# EAGLE design fat-pepper-preamp (EAGLE 7.6.0)
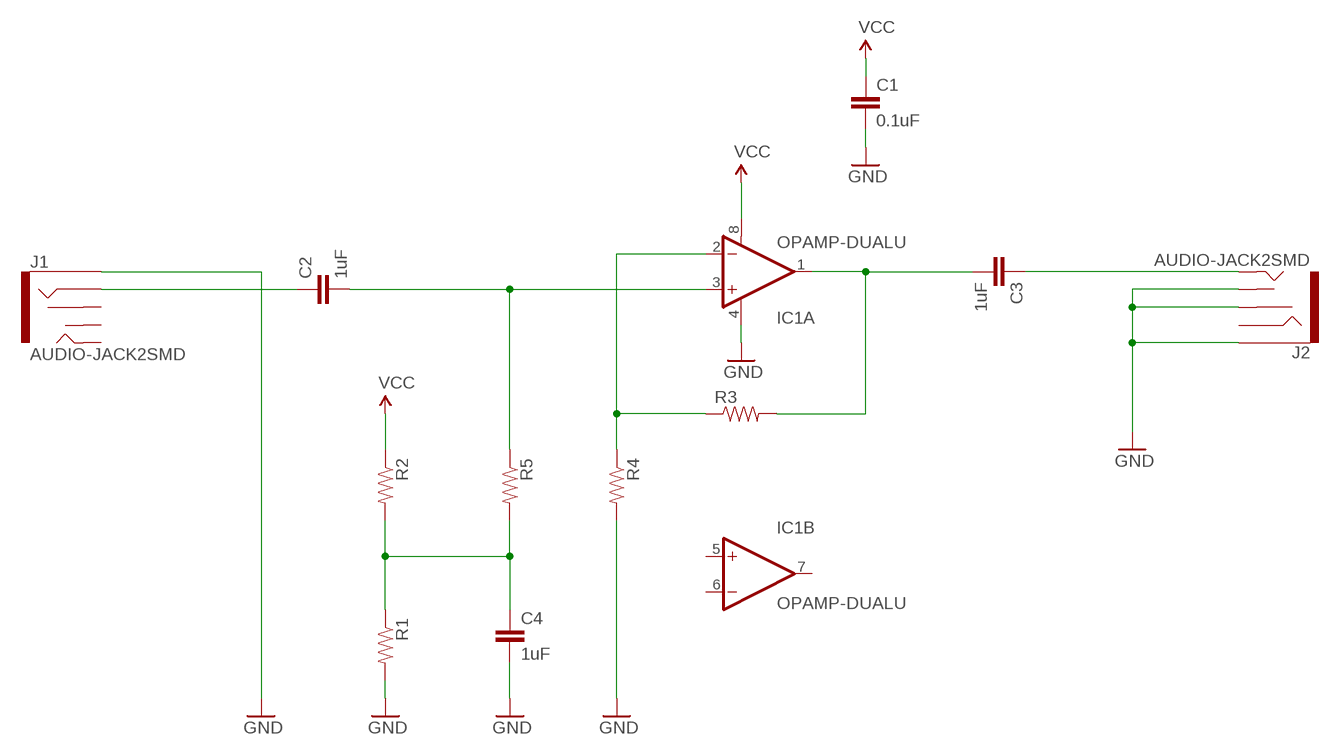
[diagram p0: schematic, sheet 1]

## Parts
C1  0.1uF  0.1UF-16V(+-10%)(0402)  [0402-CAP]
C2  1uF  CAP0603-CAP  [0603-CAP]
C3  1uF  CAP0603-CAP  [0603-CAP]
C4  1uF  CAP0603-CAP  [0603-CAP]
IC1  OPAMP-DUALU  [SO08]
J1  AUDIO-JACK2SMD  [AUDIO-JACK-3.5MM-SMD]
J2  AUDIO-JACK2SMD  [AUDIO-JACK-3.5MM-SMD]
R1  RESISTOR0603-RES  [0603-RES]
R2  RESISTOR0603-RES  [0603-RES]
R3  RESISTOR0603-RES  [0603-RES]
R4  RESISTOR0603-RES  [0603-RES]
R5  RESISTOR0603-RES  [0603-RES]

## Nets
GND: C1.2 C4.2 IC1.4(A:V-) J1.SLEEVE J2.RSH J2.SLEEVE J2.TSH R1.2 R4.2
N$1: C4.1 R1.1 R2.2 R5.2
N$2: C2.2 IC1.3(A:+IN) R5.1
N$3: IC1.2(A:-IN) R3.1 R4.1
N$4: C3.2 IC1.1(A:OUT) R3.2
N$5: C3.1 J2.TIP
N$6: C2.1 J1.RING
VCC: C1.1 IC1.8(A:V+) R2.1
Unconnected: IC1.5(B:+IN) IC1.6(B:-IN) IC1.7(B:OUT) J1.RSH J1.TIP J1.TSH J2.RING

## Library data of the parts
C1 = SparkFun-Capacitors:0.1UF-16V(+-10%)(0402); PROD_ID: CAP-12416
C2-C4 = SparkFun-Passives:CAP: Capacitor Standard 0603 ceramic capacitor, and 0.1" leaded capacitor.
IC1 = SparkFun-AnalogIC:OPAMP-DUAL: Generic op-amp footprint
J1 J2 = SparkFun-Connectors:AUDIO-JACK2: Stereo audio jack with bypass switches. SMT version used on LilyPad MP3 board.; PROD_ID: CONN-10353
R1-R5 = SparkFun-Passives:RESISTOR: Resistor Basic schematic elements and footprints for 0603, 1206, and PTH resistors.

## Board
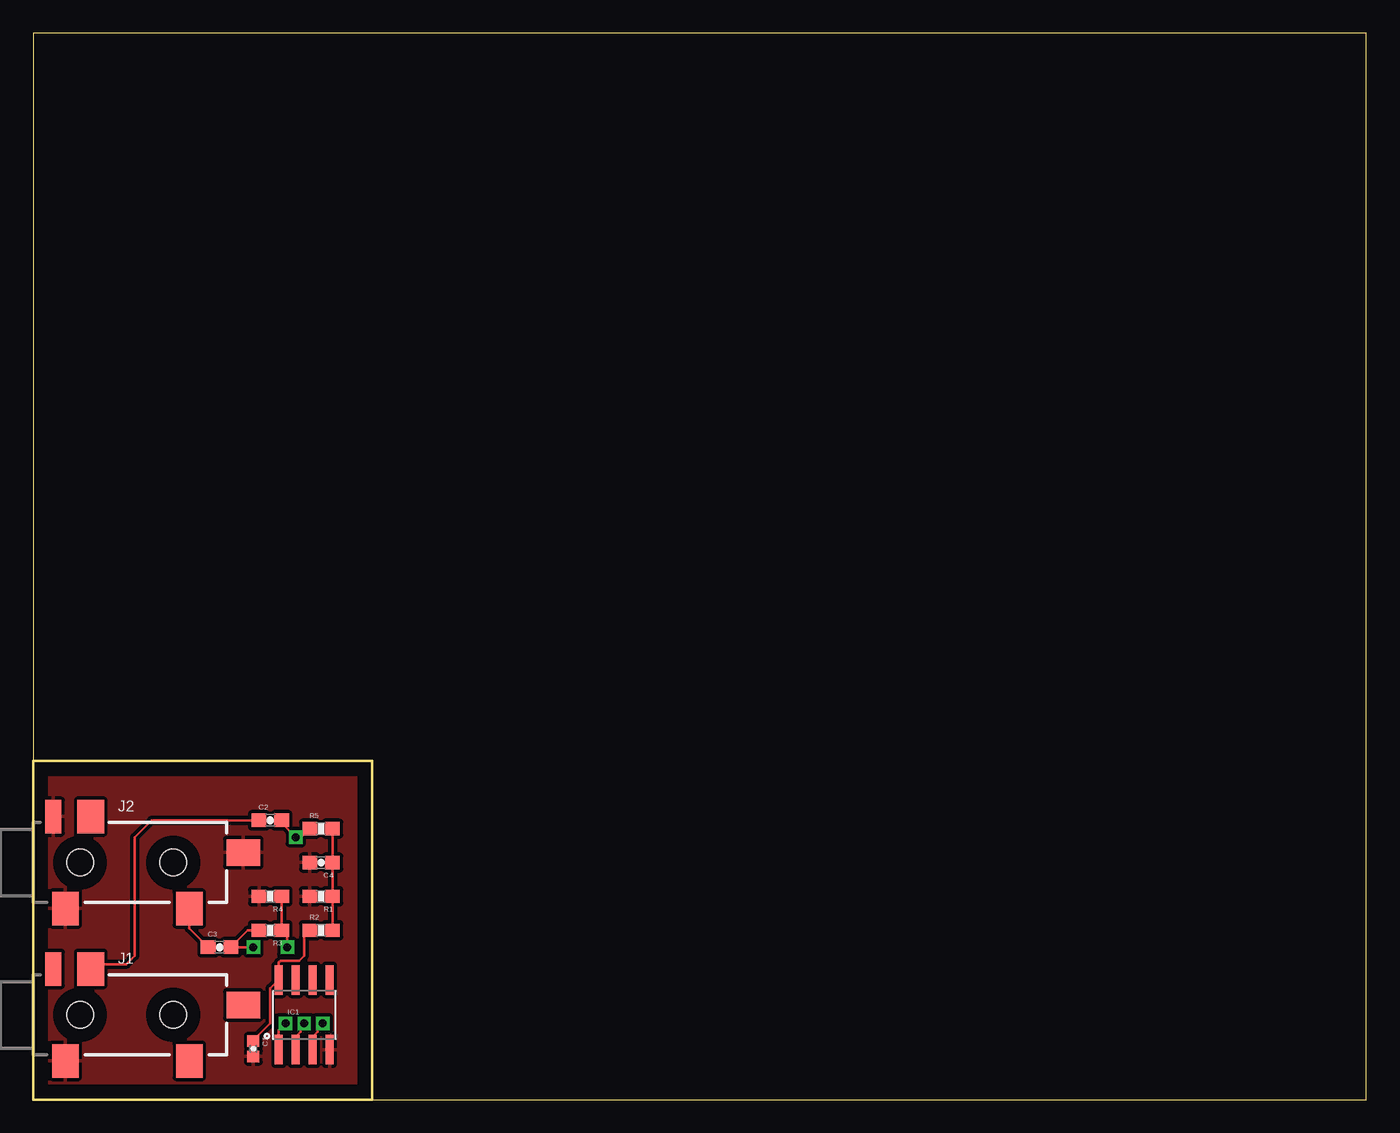
[diagram p1: board, top side]
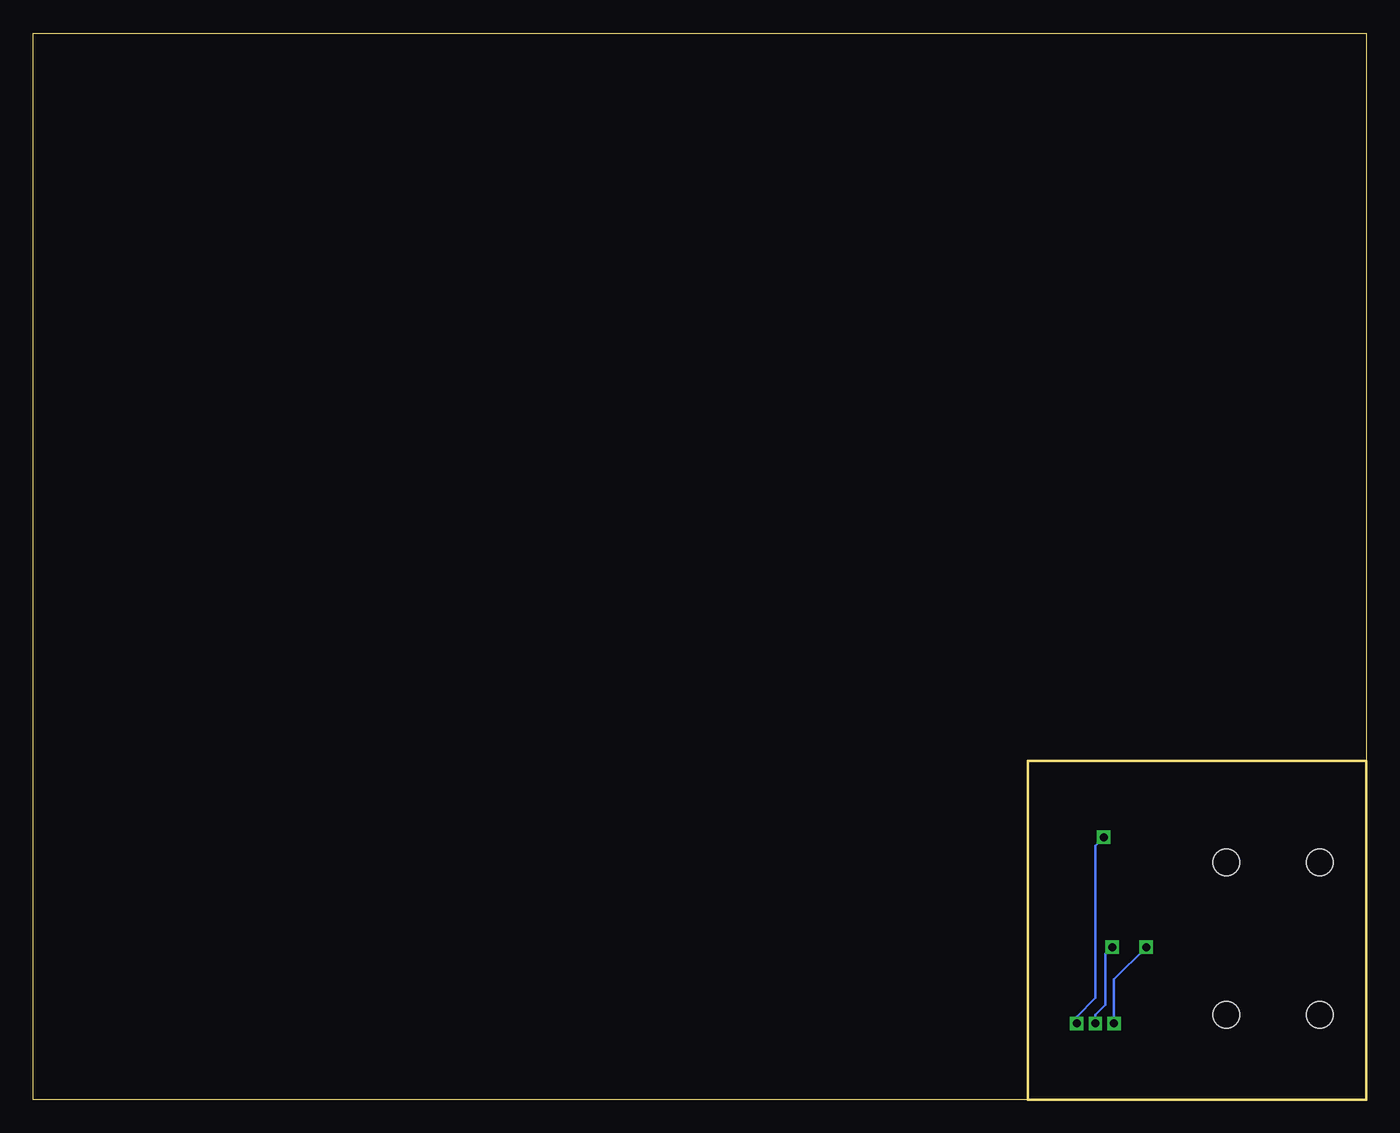
[diagram p2: board, bottom side, seen from below]

Size 100 x 80 mm. Coordinates in mm from the lower left corner, seen from the top.
Outline: 25.4,0 100,0 100,80 0,80 0,25.4
Outline: 0,25.4 0,0 25.4,0
Outline: 0,25.4 25.4,25.4 25.4,0
Copper layers (1*16): Top 0.035mm / dielectric 1.5mm / Bottom 0.035mm
Design rules "default": minimum track width 10mil, minimum drill 24mil, track to track 8mil, track to pad 8mil, pad to pad 8mil, via to via 8mil, smd to smd 8mil, copper to edge 40mil, drill to drill 8mil, minimum pad ring 10mil, minimum via ring 8mil, stop-mask expansion 4mil, vias tented up to drill 0mil, thermal gap 10mil

### Footprints (pad centres in the part's own frame; a part is rotated, then mirrored left to right if it is on the bottom)
0402-CAP = smd 0.85 x 0.9: 1 -0.58,0; 2 0.58,0
0603-CAP = smd 1.1 x 1: 1 -0.85,0; 2 0.85,0
SO08 = smd 0.61 x 2.21: 1 -1.905,-2.616; 2 -0.635,-2.616; 3 0.635,-2.616; 4 1.905,-2.616; 5 1.905,2.616; 6 0.635,2.616; 7 -0.635,2.616; 8 -1.905,2.616
AUDIO-JACK-3.5MM-SMD = smd 2 x 2.5: RING 4.3,3.45; SLEEVE 2.4,-3.45; TIP 11.7,-3.45 | smd 1.2 x 2.5: RSH 1.5,3.45 | smd 2.5 x 2: TSH 15.75,0.75 | hole 2: 3.5,0; 10.5,0
0603-RES = smd 1.1 x 1: 1 -0.85,0; 2 0.85,0

### Placement (x,y rotation side)
C1  16.51,3.81 270 top
C2  17.78,20.95 0 top
C3  13.97,11.43 0 top
C4  21.59,17.78 180 top
IC1  20.32,6.35 0 top
J1  0,6.35 0 top
J2  0,17.78 0 top
R1  21.59,15.24 180 top
R2  21.59,12.7 0 top
R3  17.78,12.7 180 top
R4  17.78,15.24 180 top
R5  21.59,20.32 0 top

### Tracks (layer width: path | path; a pad name or v marks a point on that pad's centre or on a via)
GND
  Top 0.203: J2.RSH 1.27,21 | J1.SLEEVE 1.91,3.4
  pour Top (isolate 0.254): 0,25.4 0,0 25.4,0 25.4,25.4
N$1
  Top 0.203: R2.2 R1.1 C4.1 R5.2
N$2  (via drill 0.6)
  Top 0.203: IC1.3 20.95,4.7 21.34,5.08 21.34,5.33 v21.72,5.71 | R5.1 20.11,19.68 v19.68,19.68 18.63,20.74 C2.2
  Bottom 0.203: v21.72,5.71 21.72,6.22 20.32,7.62 20.32,19.05 v19.68,19.68
N$3  (via drill 0.6)
  Top 0.203: R4.1 R3.1 19.05,12.28 v19.05,11.43 | IC1.2 19.68,4.7 20.07,5.08 20.07,5.46 v20.32,5.71
  Bottom 0.203: v20.32,5.71 20.32,6.35 19.56,7.11 19.56,10.92 v19.05,11.43
N$4  (via drill 0.6)
  Top 0.203: R3.2 16.09,12.7 C3.2 v16.51,11.43 | IC1.1 18.41,5.21 v18.92,5.71
  Bottom 0.203: v16.51,11.43 18.92,9.02 v18.92,5.71
N$5
  Top 0.203: C3.1 11.7,12.85 J2.TIP
N$6
  Top 0.203: C2.1 8.89,20.95 7.62,19.68 7.62,10.79 6.99,10.16 4.66,10.16 J1.RING
VCC
  Top 0.203: C1.1 16.51,4.45 17.78,5.71 17.78,8.33 IC1.8 18.41,10.29 18.54,10.41 19.94,10.41 20.32,10.79 20.32,12.28 R2.1